# Altium schematic sheet St1x.SchDoc: T12-PD-SolderingPen
size A4 portrait; DrawnBy: Leon.Mao; Engineer: Leon.Mao; Address3: Building 1, No. 52, DongFeng Nanshe road, Humen Town, Dongguan City,; DocumentNumber: 1; Revision: V02; SheetNumber: 1; SheetTotal: 1
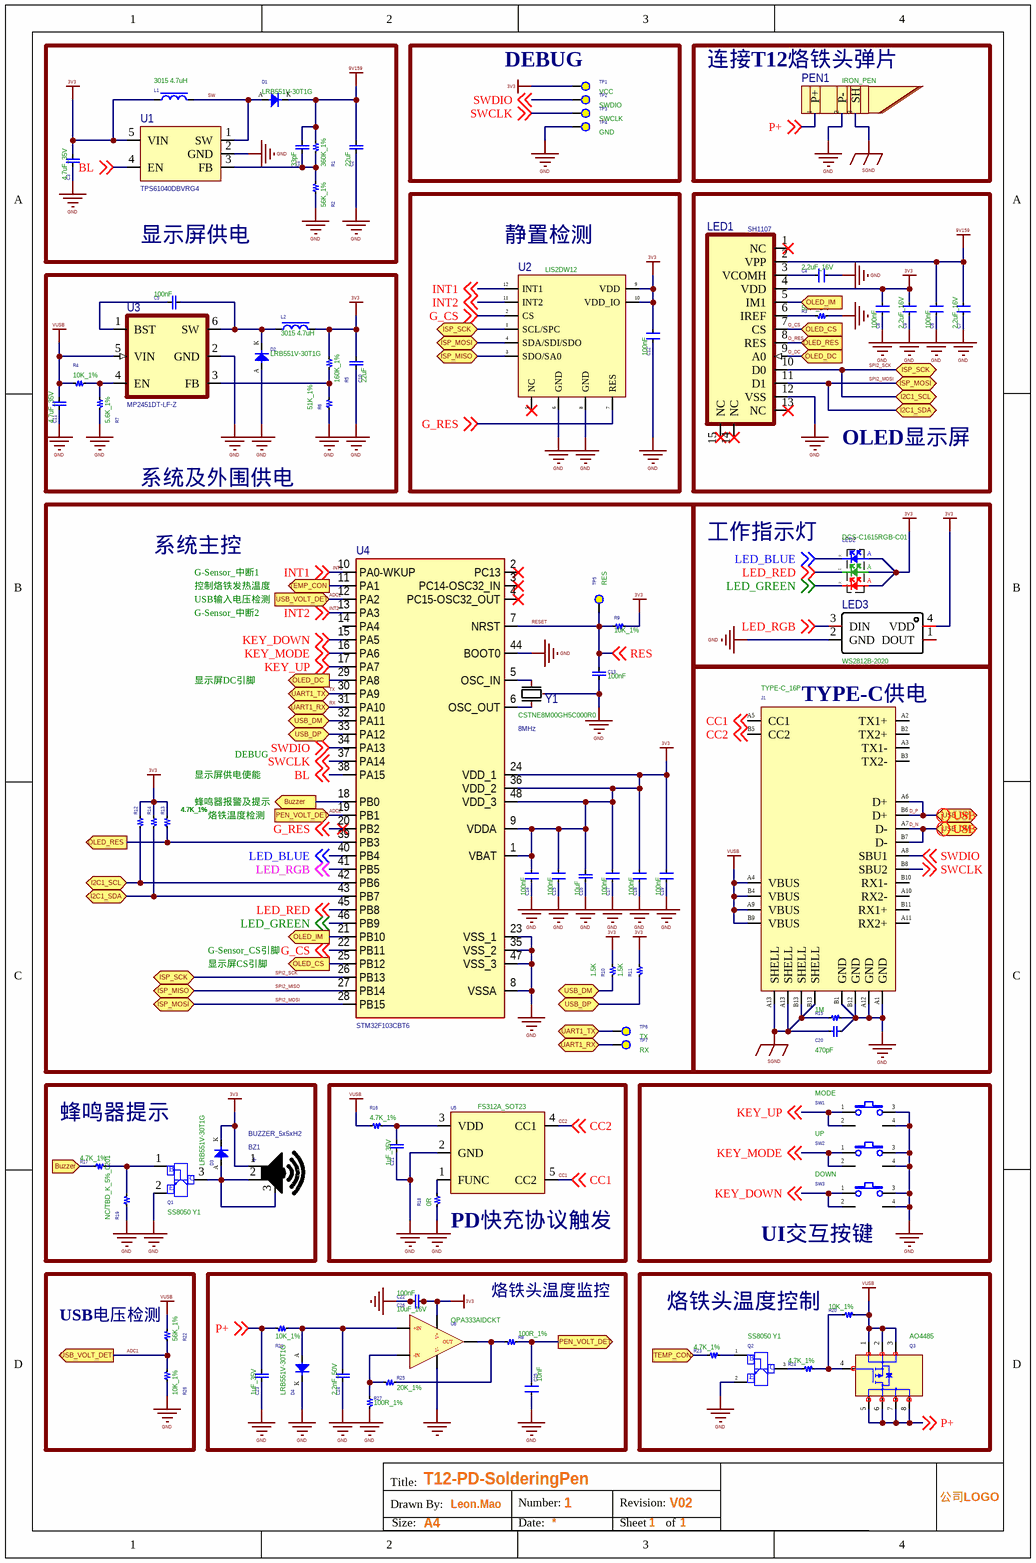
[diagram p0: St1x.SchDoc]

## Parts
BZ1  BUZZER_5x5xH2  [BUZ-SMD_GSC5025YA]
C1  33pF  [C1U0402]
C2  22uF  [CL0603]
C3  4.7uF_35V  [C4U0402]
C4  2.2uF_16V  [C4U0402]
C5  100nF  [C1U0402]
C6  100nF  [C1U0402]
C7  2.2uF_16V  [C4U0402]
C8  100nF  [C1U0402]
C9  2.2uF_16V  [C4U0402]
C10  22uF  [CL0603]
C11  4.7uF_35V  [C4U0402]
C12  100nF  [C1U0402]
C13  100nF  [C1U0402]
C14  100nF  [C1U0402]
C15  100nF  [C1U0402]
C16  10uF  [C4U0402]
C17  100nF  [C1U0402]
C18  100nF  [C1U0402]
C19  100nF  [C1U0402]
C20  470pF  [C0402]
C21  1uF_35V  [C1U0402]
C22  100nF  [C1U0402]
C23  1uF_35V  [C1U0402]
C24  2.2nF_50V  [C4U0402]
C25  10nF  [C1U0402]
C26  10uF_16V  [C4U0402]
D1  LRB551V-30T1G  [SOD-323_AK]
D2  LRB551V-30T1G  [SOD-323_AK]
D3  LRB551V-30T1G  [SOD-323_AK]
D4  LRB551V-30T1G  [SOD-323_AK]
J1  TYPE-C_16P  [TYPE-C_16P]
L1  3015 4.7uH  [INDC3015]
L2  3015 4.7uH  [INDC3015]
LED1  SH1107  [CON_13P_0.7mm-FPC]
LED2  DCS-C1615RGB-C01  [RGB_DCS-C1615RGB-C01]
LED3  WS2812B-2020  [LED_2020]
PEN1  IRON_PEN  [T13]
Q1  SS8050 Y1  [SOT-23_123]
Q2  SS8050 Y1  [SOT-23_123]
Q3  AO4485  [SO-8M]
R1  360K_1%  [RN0402]
R2  56K_1%  [RN0402]
R3  560k_1%  [RN0402]
R4  10K_1%  [RN0402]
R5  160K_1%  [RN0402]
R6  51K_1%  [RN0402]
R7  5.6K_1%  [RN0402]
R8  100R_1%  [RN0402]
R9  10K_1%  [RN0402]
R10  1.5K  [RN0402]  (no BOM)
R11  1.5K  [RN0402]  (no BOM)
R12  4.7K_1%  [RN0402]
R13  4.7K_1%  [RN0402]
R14  4.7K_1%  [RN0402]
R15  1M  [RN0402]
R16  4.7K_1%  [RN0402]
R17  4.7K_1%  [RN0402]
R18  0R  [RN0402]
R19  NC/TBD_K_5%_0201  [RN0402]
R20  10K_1%  [RN0402]
R21  10K_1%  [RN0603]
R22  56K_1%  [RN0402]
R23  4.7K_1%  [RN0402]
R24  4.7K_1%  [RN0402]
R25  20K_1%  [RN0402]
R26  10K_1%  [RN0402]
R27  100R_1%  [RN0402]
SW1  MODE  [KEY-SMD_4P-L4.2-W3.2-P2.20-LS5.1-TL]
SW2  UP  [KEY-SMD_4P-L4.2-W3.2-P2.20-LS5.1-TL]
SW3  DOWN  [KEY-SMD_4P-L4.2-W3.2-P2.20-LS5.1-TL]
TP1  VCC  [SMD0808]  (no BOM)
TP2  SWDIO  [SMD0808]  (no BOM)
TP3  SWCLK  [SMD0808]  (no BOM)
TP4  GND  [SMD0808]  (no BOM)
TP5  RES  [SMD0808]  (no BOM)
TP6  TX  [SMD0808]  (no BOM)
TP7  RX  [SMD0808]  (no BOM)
U1  TPS61040DBVRG4  [SOT23-5]
U2  LIS2DW12  [LGA12_20x20x07]
U3  MP2451DT-LF-Z  [SOT23-6]
U4  STM32F103CBT6  [LQFP48-7x7mm]
U5  FS312A_SOT23  [SOT23-5]
U6  OPA333AIDCKT  [SOT23-5]
Y1  CSTNE8M00GH5C000R0  value 8MHz  [OSC-SMD_3P-L3.2-W1.3-P1.20-L]

## Blocks framed on the sheet
显示屏供电: C1-C3 D1 L1 R1 R2 U1
DEBUG: TP1-TP4
连接T12烙铁头弹片: PEN1
静置检测: C12 U2
OLED显示屏: C4 C6-C9 LED1 R3
系统及外围供电: C5 C10 C11 D2 L2 R4-R7 U3
系统主控: C13-C19 R9-R14 TP5-TP7 U4 Y1
工作指示灯: LED2 LED3
TYPE-C供电: C20 J1 R15
蜂鸣器提示: BZ1 D3 Q1 R17 R19
PD快充协议触发: C21 R16 R18 U5
UI交互按键: SW1-SW3
USB电压检测: R22 R26
烙铁头温度监控: C22-C26 D4 R8 R21 R25 R27 U6
烙铁头温度控制: Q2 Q3 R20 R23 R24

## Ports
Buzzer (in), Buzzer (out), I2C1_SCL (bidir), I2C1_SDA (bidir), ISP_MISO (bidir), ISP_MOSI (bidir), ISP_SCK (bidir), OLED_CS (in), OLED_CS (out), OLED_DC (in), OLED_DC (out), OLED_IM (in), OLED_IM (out), OLED_RES (in), OLED_RES (out), PEN_VOLT_DET (in), PEN_VOLT_DET (out), TEMP_CON (in), TEMP_CON (out), UART1_RX (bidir), UART1_TX (bidir), USB_DM (bidir), USB_DP (bidir), USB_VOLT_DET (in), USB_VOLT_DET (out)

## Nets
3V3: BZ1.1(+) C3.2 C8.1 C9.1 C10.2 C12.1 C14.1 C15.1 C16.2 C17.1 C18.1 C19.1 C22.2 C26.1 D3.K(CATHODE) L1.1 L2.1 LED1.4(VDD) LED2.A LED3.4(VDD) R5.1 R9.1 R10.1 R11.1 R12.2 R13.1 R14.2 TP1.1 U1.5(VIN) U2.9(VDD) U2.10(VDD_IO) U4.1(VBAT) U4.9(VDDA) U4.24(VDD_1) U4.36(VDD_2) U4.48(VDD_3) U6.5(V+)
9V159: C1.2 C2.2 C6.1 C7.1 D1.K(CATHODE) LED1.2(VPP) R1.1
GND: C2.1 C3.1 C4.2 C6.2 C7.2 C8.2 C9.2 C10.1 C11.1 C12.2 C13.2 C14.2 C15.2 C16.1 C17.2 C18.2 C19.2 C20.1 C21.1 C22.1 C23.2 C24.2 C25.2 C26.2 D2.A(ANODE) D4.K(CATHODE) J1.A1(GND) J1.A12(GND) J1.B1(GND) J1.B12(GND) LED1.12(VSS) LED3.2(GND) PEN1.2(P-) Q1.2(EMITTER) Q2.2(EMITTER) R2.1 R3.1 R6.1 R7.2 R15.2 R18.2 R19.1 R26.1 R27.2 SW1.3 SW1.4 SW2.3 SW2.4 SW3.3 SW3.4 TP4.1 U1.2(GND) U2.6(GND) U2.8(GND) U3.2(GND) U4.8(VSSA) U4.23(VSS_1) U4.35(VSS_2) U4.44(BOOT0) U4.47(VSS_3) U5.2(GND) U6.2(V-) Y1.2(GND)
SGND: C20.2 J1.A13(SHELL) J1.B13(SHELL) PEN1.3(SH) R15.1
VUSB: C11.2 J1.A4(VBUS) J1.A9(VBUS) J1.B4(VBUS) J1.B9(VBUS) Q3.1(S) Q3.2(S) Q3.3(S) R4.2 R16.1 R20.2 R22.2 U3.5(VIN)
ADC1: R22.1 R26.2 U4.12(PA2) ; port USB_VOLT_DET
ADC2: C25.1 R8.1 U4.19(PB1) ; port PEN_VOLT_DET
BL: U1.4(EN) U4.38(PA15) ; off-sheet BL
Buzzer: R17.1 U4.18(PB0) ; port Buzzer
CC1: J1.A5(CC1) U5.5(CC2) ; off-sheet CC1
CC2: J1.B5(CC2) U5.4(CC1) ; off-sheet CC2
D_N: J1.A7(D-) J1.B7(D-) R10.2 U4.32(PA11) ; port USB_DM
D_P: J1.A6(D+) J1.B6(D+) R11.2 U4.33(PA12) ; port USB_DP
G_CS: U2.2(CS) U4.22(PB11) ; off-sheet G_CS
G_RES: U2.7(RES) U4.20(PB2) ; off-sheet G_RES
INT1: U2.12(INT1) U4.10(PA0-WKUP) ; off-sheet INT1
INT2: U2.11(INT2) U4.13(PA3) ; off-sheet INT2
KEY_DOWN: SW3.1 SW3.2 U4.15(PA5) ; off-sheet KEY_DOWN
KEY_MODE: SW2.1 SW2.2 U4.16(PA6) ; off-sheet KEY_MODE
KEY_UP: SW1.1 SW1.2 U4.17(PA7) ; off-sheet KEY_UP
LED_BLUE: LED2.BC U4.40(PB4) ; off-sheet LED_BLUE
LED_GREEN: LED2.RC U4.46(PB9) ; off-sheet LED_GREEN
LED_RED: LED2.GC U4.45(PB8) ; off-sheet LED_RED
LED_RGB: LED3.3(DIN) U4.41(PB5) ; off-sheet LED_RGB
O_CS: LED1.7(CS) U4.25(PB12) ; port OLED_CS
O_DC: LED1.9(A0) U4.29(PA8) ; port OLED_DC
O_RES: LED1.8(RES) R13.2 U4.39(PB3) ; port OLED_RES
OLED_IM: LED1.5(IM1) U4.21(PB10) ; port OLED_IM
P+: C23.1 PEN1.1(P+) Q3.5(D) Q3.6(D) Q3.7(D) Q3.8(D) R21.2 ; off-sheet P+
RESET: C13.1 R9.2 TP5.1 U4.7(NRST) ; off-sheet RES  [also labelled RES]
RX: TP7.1 U4.31(PA10) ; port UART1_RX
SPI2_MISO: U2.3(SDO/SA0) U4.27(PB14) ; port ISP_MISO
SPI2_MOSI: LED1.11(D1) R14.1 U2.4(SDA/SDI/SDO) U4.28(PB15) U4.43(PB7) ; port ISP_MOSI, port I2C1_SDA
SPI2_SCK: LED1.10(D0) R12.1 U2.1(SCL/SPC) U4.26(PB13) U4.42(PB6) ; port ISP_SCK, port I2C1_SCL
SW: D1.A(ANODE) L1.2 U1.1(SW)
SWCLK: J1.B8(SBU2) TP3.1 U4.37(PA14) ; off-sheet SWCLK
SWDIO: J1.A8(SBU1) TP2.1 U4.34(PA13) ; off-sheet SWDIO
TEMP_CON: R23.1 U4.11(PA1) ; port TEMP_CON
TX: TP6.1 U4.30(PA9) ; port UART1_TX
NetBZ1_2: BZ1.2(-) BZ1.3(-) D3.A(ANODE) Q1.3(COLLECTOR)
NetC1_1: C1.1 R1.2 R2.2 U1.3(FB)
NetC4_1: C4.1 LED1.3(VCOMH)
NetC5_1: C5.1 D2.K(CATHODE) L2.2 U3.6(SW)
NetC5_2: C5.2 U3.1(BST)
NetC21_2: C21.2 R16.2 U5.3(VDD)
NetC24_1: C24.1 D4.A(ANODE) R21.1 U6.3(+IN)
NetLED1_6: LED1.6(IREF) R3.2
NetQ1_1: Q1.1(BASE) R17.2 R19.2
NetQ2_1: Q2.1(BASE) R23.2
NetQ2_3: Q2.3(COLLECTOR) R24.1
NetQ3_4: Q3.4(G) R20.1 R24.2
NetR4_1: R4.1 R7.1 U3.4(EN)
NetR5_2: R5.2 R6.2 U3.3(FB)
NetR8_2: R8.2 R25.1 U6.1(OUT)
NetR18_1: R18.1 U5.1(FUNC)
NetR25_2: R25.2 R27.1 U6.4(-IN)
NetU4_5: U4.5(OSC_IN) Y1.1(OSC1)
NetU4_6: U4.6(OSC_OUT) Y1.3(OSC2)

Not connected (* = marked no-connect by the designer): J1 A2(TX1+) A3(TX1-) A10(RX2-) A11(RX2+) B2(TX2+) B3(TX2-) B10(RX1-) B11(RX1+); LED1 1(NC)* 13(NC)* 14(NC)* 15(NC)*; LED3 1(DOUT); U2 5(NC)*; U4 2(PC13)* 3(PC14-OSC32_IN)* 4(PC15-OSC32_OUT)* 14(PA4)

## Layout directives
differential pair; differential pair class USB: D_N, D_P

## Notes on the sheet
- G-Sensor_中断1
- G-Sensor_中断2
- 控制烙铁发热温度
- USB输入电压检测
- 显示屏DC引脚
- 显示屏供电使能
- DEBUG
- 蜂鸣器报警及提示
- 烙铁温度检测
- 显示屏CS引脚
- G-Sensor_CS引脚
- Title:
- Drawn By:
- Number:
- Revision:
- 公司LOGO
- Size:
- A4
- Date:
- Sheet
- of
- (in symbol NPN) B; C; E

## Library data of the parts
BZ1 = BZ: 电磁无源蜂鸣器(外部驱动)
C1-C19 C21-C26 = CAP_NP: 贴片电容
C20 = CAP NP_1: 贴片电容
D1-D4 = DIODE: 肖特基二极管
J1 = TYPE-C_RI: TYPE-C母座
L1 L2 = INDUCTOR_2: 功率电感
LED1 = SH1107: QG-2880TSWKG01; MF: {'manufacturer': u'Texas Instruments'}; MP: LP2985AIM5-5.0; Availability: Unavailable; Price: None; Package: None; Value: *
LED2 = LED_RGBS: 红绿蓝三色发光二极管
LED3 = YO-WS2812B-3528反贴: Manufacturer: null; Name: Yo-WS2812B-3528反贴雾状; Add into BOM: yes; Symbol: YO-WS2812B-3528反贴; Device: YO-WS2812B-3528反贴; Convert to PCB: yes; Supplier: LCSC; Supplier Part: C9900003682; Manufacturer Part: Yo-WS2812B-3528反贴雾状
Q1 Q2 = NPN: NPN三极管
Q3 = AO4485: P沟道 40V 10A
R1-R27 = ResSemi_3: 贴片电阻
SW1-SW3 = SW PUSHBUTTON: 轻触开关
TP1-TP7 = TEST
U1 = TPS61040DBVRG4_[C7722]: DC-DC芯片; ComponentLink1Description: 供应商链接; ComponentLink1URL: http://www.szlcsc.com/product/details_8199.html; Package: SOT-23-5; Supplier: LC; SuppliersPartNumber: C7722
U3 = MP2451DT-LF-Z: MF: {'manufacturer': u'Texas Instruments'}; MP: LP2985AIM5-5.0; Availability: Unavailable; Price: None; Package: None; Value: *
U4 = STM32F103CBT6: No Description Available; Mfr_Name: STMicroelectronics; Copyright: Copyright (C) 2023 Ultra Librarian. All rights reserved.; Manufacturer_Part_Number: STM32F103CBT6; RefDes: RefDes; Type: DEV
U5 = FS312A: USB Type-C PD快充协议智能触发芯片
U6 = OPA333_SOT23
Y1 = CSTNE8M00GH5C000R0: 频率:8MHz;频率容差:±0.07%;内藏负载电容:33pF;谐振阻抗:40Ω;; Manufacturer: muRata(村田); Add into BOM: yes; Frequency Stability: ±0.13%; Frequency Tolerance: ±0.07%; Built-in Load Capacitance: 33pF; Resonant Impedance: 40Ω; NAME: OSC2; NUMBER: 3; Pin Type: IN; Symbol: CSTNE8M00GH5C000R0; Device: CSTNE8M00GH5C000R0; LCSC Part Name: 8MHz ±0.07% 33pF; Supplier Part: C341525; Manufacturer Part: CSTNE8M00GH5C000R0; Supplier Footprint: SMD3213-3P; Datasheet: https://atta.szlcsc.com/upload/public/pdf/source/20181211/C341525_832BA077079E4863A5153C1DB98581D5.pdf; Supplier: LCSC; Convert to PCB: yes; Operating Temperature: -40~+125
U2 = LIS2DW12: PCB DECAL: LIS2DW12